# Altium schematic sheet MCU.SchDoc
size A
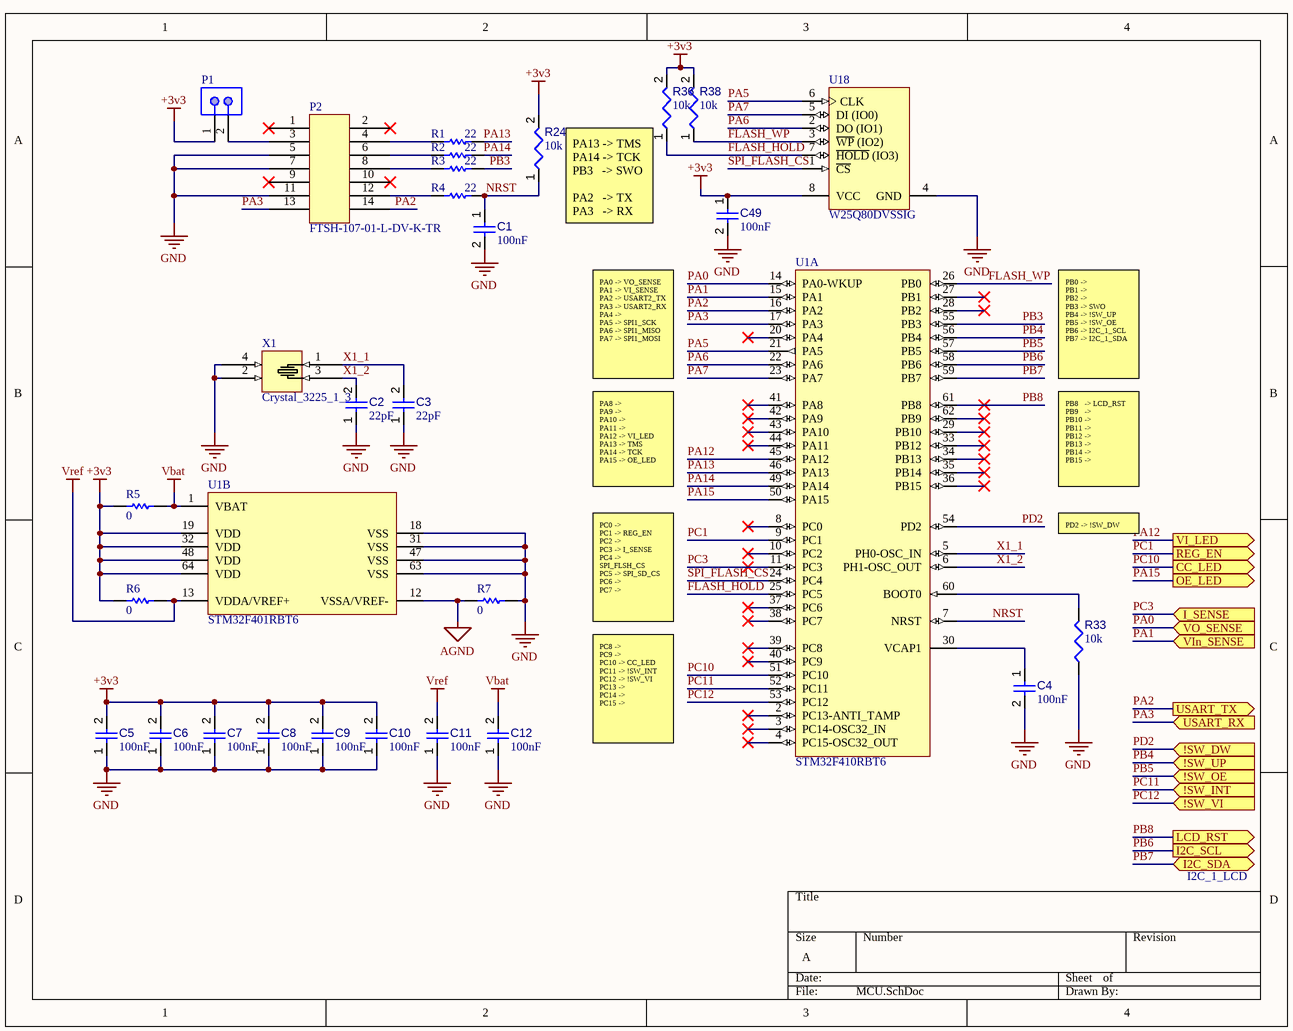
[diagram p0: MCU.SchDoc]

## Parts
C1  value 100nF  [CAPC2013X95X50ML10T25]  (hidden comment: Capacitor 100 nF +/-10% 50 V 0805)
C2  value 22pF  [CAPC2013X95X50ML10T25]  (hidden comment: Capacitor 100 nF +/-10% 50 V 0805)
C3  value 22pF  [CAPC2013X95X50ML10T25]  (hidden comment: Capacitor 100 nF +/-10% 50 V 0805)
C4  value 100nF  [CAPC2013X95X50ML10T25]  (hidden comment: Capacitor 100 nF +/-10% 50 V 0805)
C5  value 100nF  [CAPC2013X95X50ML10T25]  (hidden comment: Capacitor 100 nF +/-10% 50 V 0805)
C6  value 100nF  [CAPC2013X95X50ML10T25]  (hidden comment: Capacitor 100 nF +/-10% 50 V 0805)
C7  value 100nF  [CAPC2013X95X50ML10T25]  (hidden comment: Capacitor 100 nF +/-10% 50 V 0805)
C8  value 100nF  [CAPC2013X95X50ML10T25]  (hidden comment: Capacitor 100 nF +/-10% 50 V 0805)
C9  value 100nF  [CAPC2013X95X50ML10T25]  (hidden comment: Capacitor 100 nF +/-10% 50 V 0805)
C10  value 100nF  [CAPC2013X95X50ML10T25]  (hidden comment: Capacitor 100 nF +/-10% 50 V 0805)
C11  value 100nF  [CAPC2013X95X50ML10T25]  (hidden comment: Capacitor 100 nF +/-10% 50 V 0805)
C12  value 100nF  [CAPC2013X95X50ML10T25]  (hidden comment: Capacitor 100 nF +/-10% 50 V 0805)
C49  value 100nF  [CAPC2013X95X50LL10T25]  (hidden comment: Capacitor 100 nF +/-10% 50 V 0805)
P1  GRPB021VWVN-RC  [SLIN-GRPB021VWVN-RC_V]  (value not drawn)
P2  FTSH-107-01-L-DV-K-TR  [FTSH-107-01-L-DV-K-TR-Footprint-1]
R1  value 22  [RESC2013X50X35ML15T15]  (hidden comment: Resistor 0R +/- 1% 0805 125 mW)
R2  value 22  [RESC2013X50X35ML15T15]  (hidden comment: Resistor 0R +/- 1% 0805 125 mW)
R3  value 22  [RESC2013X50X35ML15T15]  (hidden comment: Resistor 0R +/- 1% 0805 125 mW)
R4  value 22  [RESC2013X50X35ML15T15]  (hidden comment: Resistor 0R +/- 1% 0805 125 mW)
R5  value 0  [RESC2013X50X35ML15T15]  (hidden comment: Resistor 0R +/- 1% 0805 125 mW)
R6  value 0  [RESC2013X50X35ML15T15]  (hidden comment: Resistor 0R +/- 1% 0805 125 mW)
R7  value 0  [RESC2013X50X35ML15T15]  (hidden comment: Resistor 0R +/- 1% 0805 125 mW)
R24  value 10k  [RESC2013X50X35ML15T15]  (hidden comment: Resistor 10k +/-1% 0805 125 mW)
R33  value 10k  [RESC0805(2012)_L]  (hidden comment: Resistor 470R +/-5% 0805 125 mW)
R36  value 10k  [RESC2013X50X35ML15T15]  (hidden comment: Resistor 10k +/-1% 0805 125 mW)
R38  value 10k  [RESC2013X50X35ML15T15]  (hidden comment: Resistor 10k +/-1% 0805 125 mW)
U1  STM32F410RBT6  [STM-LQFP64_N]  (parts A,B of 2)
U18  W25Q80DVSSIG  [WINB-SOIC-8_L]
X1  Crystal_3225_1_3  [Crystal_3225_1_3-Footprint-1]

## Ports
!SW_DW (in), !SW_INT (in), !SW_OE (in), !SW_UP (in), !SW_VI (in), CC_LED (out), I2C_SCL (out), I2C_SDA (bidir), I_SENSE (in), LCD_RST (out), OE_LED (out), REG_EN (out), USART_RX (in), USART_TX (out), VI_LED (out), VIn_SENSE (in), VO_SENSE (in)

## Nets
+3v3: C5.2 C6.2 C7.2 C8.2 C9.2 C10.2 C49.1 P1.1 R5.1 R6.1 R24.2 R36.2 R38.2 U1.19(VDD) U1.32(VDD) U1.48(VDD) U1.64(VDD) U18.8(VCC)
AGND: R7.1 U1.12(VSSA/VREF-)
GND: C1.2 C2.1 C3.1 C4.2 C5.1 C6.1 C7.1 C8.1 C9.1 C10.1 C11.1 C12.1 C49.2 P2.5 P2.7 P2.11 R7.2 R33.1 U1.18(VSS) U1.31(VSS) U1.47(VSS) U1.63(VSS) U18.4(GND) X1.2(GND) X1.4(GND)
Vbat: C12.2 R5.2 U1.1(VBAT)
Vref: C11.2 R6.2 U1.13(VDDA/VREF+)
FLASH_HOLD: R36.1 U1.25(PC5) U18.7(~{HOLD}_(IO3))
FLASH_WP: R38.1 U1.26(PB0) U18.3(~{WP}_(IO2))
NRST: C1.1 R4.2 R24.1 U1.7(NRST)
PA0: U1.14(PA0-WKUP) ; port VO_SENSE
PA1: U1.15(PA1) ; port VIn_SENSE
PA2: P2.14 U1.16(PA2) ; port USART_TX
PA3: P2.13 U1.17(PA3) ; port USART_RX
PA5: U1.21(PA5) U18.6(CLK)
PA6: U1.22(PA6) U18.2(DO_(IO1))
PA7: U1.23(PA7) U18.5(DI_(IO0))
PA12: U1.45(PA12) ; port VI_LED
PA13: R1.2 U1.46(PA13)
PA14: R2.2 U1.49(PA14)
PA15: U1.50(PA15) ; port OE_LED
PB3: R3.2 U1.55(PB3)
PB4: U1.56(PB4) ; port !SW_UP
PB5: U1.57(PB5) ; port !SW_OE
PB6: U1.58(PB6) ; port I2C_SCL
PB7: U1.59(PB7) ; port I2C_SDA
PB8: U1.61(PB8) ; port LCD_RST
PC1: U1.9(PC1) ; port REG_EN
PC3: U1.11(PC3) ; port I_SENSE
PC10: U1.51(PC10) ; port CC_LED
PC11: U1.52(PC11) ; port !SW_INT
PC12: U1.53(PC12) ; port !SW_VI
PD2: U1.54(PD2) ; port !SW_DW
SPI_FLASH_CS: U1.24(PC4) U18.1(~{CS})
X1_1: C3.2 U1.5(PH0-OSC_IN) X1.1(X1)
X1_2: C2.2 U1.6(PH1-OSC_OUT) X1.3(X2)
NetC4_1: C4.1 U1.30(VCAP1)
NetP1_2: P1.2 P2.3
NetP2_4: P2.4 R1.1
NetP2_6: P2.6 R2.1
NetP2_8: P2.8 R3.1
NetP2_12: P2.12 R4.1
NetR33_2: R33.2 U1.60(BOOT0)

Not connected (* = marked no-connect by the designer): P2 1* 2* 9* 10*; U1 2(PC13-ANTI_TAMP)* 3(PC14-OSC32_IN)* 4(PC15-OSC32_OUT)* 8(PC0)* 10(PC2)* 20(PA4)* 27(PB1)* 28(PB2)* 29(PB10)* 33(PB12)* 34(PB13)* 35(PB14)* 36(PB15)* 37(PC6)* 38(PC7)* 39(PC8)* 40(PC9)* 41(PA8)* 42(PA9)* 43(PA10)* 44(PA11)* 62(PB9)*

## Notes on the sheet
- (near R36) PA13 -> TMS
  PA14 -> TCK
  PB3   -> SWO
  PA2   -> TX
  PA3   -> RX
- PA0 -> VO_SENSE
  PA1 -> VI_SENSE
  PA2 -> USART2_TX
  PA3 -> USART2_RX
  PA4 ->
  PA5 -> SPI1_SCK
  PA6 -> SPI1_MISO
  PA7 -> SPI1_MOSI
- PB0 ->
  PB1 ->
  PB2 ->
  PB3 -> SWO
  PB4 -> !SW_UP
  PB5 -> !SW_OE
  PB6 -> I2C_1_SCL
  PB7 -> I2C_1_SDA
- PA8 ->
  PA9 ->
  PA10 ->
  PA11 ->
  PA12 -> VI_LED
  PA13 -> TMS
  PA14 -> TCK
  PA15 -> OE_LED
- PB8   -> LCD_RST
  PB9   ->
  PB10 ->
  PB11 ->
  PB12 ->
  PB13 ->
  PB14 ->
  PB15 ->
- PD2 -> !SW_DW
- PC0 ->
  PC1 -> REG_EN
  PC2 ->
  PC3 -> I_SENSE
  PC4 -> SPI_FLSH_CS
  PC5 -> SPI_SD_CS
  PC6 ->
  PC7 ->
- PC8 ->
  PC9 ->
  PC10 -> CC_LED
  PC11 -> !SW_INT
  PC12 -> !SW_VI
  PC13 ->
  PC14 ->
  PC15 ->
- I2C_1_LCD

## Library data of the parts
C1-C12 = CMP-001-00018-4: Chip Capacitor, 100 nF, +/- 10%, 50 V, 0805 (2012 Metric); Voltage Rating: 50V; Capacitor Type: Ceramic; RoHS Compliant: True; Max Operating Temperature: 125°C; Mounting Technology: SM; Case/Package: 0805; Tolerance: 10%; Min Operating Temperature: -55°C; Pins: 2
C49 = CMP-001-00018-6: Chip Capacitor, 100 nF, +/- 10%, 50 V, 0805 (2012 Metric); Capacitor Type: Ceramic; Voltage Rating: 50V; Pins: 2; Max Operating Temperature: 125°C; Min Operating Temperature: -55°C; Mounting Technology: SM; Case/Package: 0805; RoHS Compliant: True; Tolerance: 10%
P1 = CMP-2000-06371-1: Male Header, Pitch 1.27 mm, 1 x 2 Position, Height 4 mm, Tail Length 2.3 mm, -40 to 105 degC, RoHS, Bulk; Manufacturer: Sullins; Dynamic Catalog: GRPB; Number of Positions Loaded: All; Other Names: S9014E-02; Connector Type: Header,Unshrouded; Catalog Drawings: S9014ESeriesTop; Number of Positions: 2; Pitch: 0.050"(1.27mm); Contact Finish Thickness: Flash; Package Description: Male Header, Pitch 1.27 mm, 1 x 2 Position, Height 4 mm, Tail Length 2.3 mm; Datasheet URL: http://www.sullinscorp.com/drawings/71_GRPB___1VWVN-RC,_10957-C.pdf; Contact Mating Length: 0.118"(3.00mm); Manufacturer URL: http://www.sullinscorp.com/; Mounting Type: ThroughHole; Termination: Solder; Category: Connectors,Interconnects; Family: RectangularConnectors-Headers,MalePins; Contact Finish: Gold; Standard Package: 1; Contact Type: MalePin; Packaging: Bulk; Number of Rows: 1; Mounting Technology: ThroughHole; Package Reference: GRPB021VWVN-RC; Datasheet Version: Rev. C, 12/2008
P2 = CMP-002-00072-1: Conn Unshrouded Header HDR 14 POS 1.27mm Solder ST SMD T/R
R1-R7 = CMP-009-00001-4: Chip Resistor, 0 Ohm, +/- 1%, 125 mW, -55 to 155 degC, 0805 (2012 Metric); Power: 125mW; Voltage Rating: 150V; Tolerance: 1%; Mounting Technology: SM; Min Operating Temperature: -55°C; Case/Package: 0805; Pins: 2; Max Operating Temperature: 155°C; RoHS Compliant: True
R24 R36 R38 = CMP-009-00018-5: Chip Resistor, 10 KOhm, +/- 1%, 125 mW, -55 to 155 degC, 0805 (2012 Metric); Power: 125mW; Voltage Rating: 150V; Tolerance: 1%; Pins: 2; Min Operating Temperature: -55°C; Case/Package: 0805; Max Operating Temperature: 155°C; RoHS Compliant: True; Mounting Technology: SM
R33 = CMP-009-00122-2: Chip Resistor, 470 Ohms, +/-5%, 125 mW, -55 to 155 degC, 0805; Power: 125mW; Tolerance: 5%; Max Operating Temperature: 155°C; Min Operating Temperature: -55°C; Pins: 2; Case/Package: 0805
U1 = CMP-0243-00094-2: ARM Cortex-M4 32-bit MCU+FPU, 105 DMIPS, 128 kB Flash, 64 kB Internal RAM, 48 I/Os, 64-pin LQFP, -40 to 85 degC, Tray; Manufacturer: STMicroelectronics; PartNumber: STM32F401RBT6; Internal RAM Size (kB): 64; FLASH Size (Prog) (kB): 128; Supply Voltage(Vcc) max (V): 3.6; I/Os (High Current): 48; Supply Voltage(Vcc) min (V): 1.8; Operating Frequency(F) (Processor speed) (MHz): 84; Core: ARM Cortex-M4; PackageDescription: 64-Pin Low Profile Quad Flat Package, 10 x 10 mm Body, 0.5 mm Pitch; Mounting Technology: Surface Mount; PackageVersion: Rev. 4, 06/2013; ComponentLink1URL: http://www.st.com/web/en/home.html; ComponentLink3Description: Package Specification; ComponentLink2Description: Datasheet; ComponentLink3URL: http://www.st.com/st-web-ui/static/active/en/resource/technical/document/datasheet/DM00037051.pdf; ComponentLink2URL: http://www.st.com/st-web-ui/static/active/en/resource/technical/document/data_brief/DM00071938.pdf; DatasheetVersion: Rev. 1; Packing: Tray; PackageReference: LQFP64; ComponentLink1Description: Manufacturer URL
U18 = CMP-2000-07408-1: Serial Flash Memory with Dual and Quad SPI, 8 Mbits, 2.7 to 3.6 V, -40 to 85 degC, 8-Pin SOIC (SS), RoHS, Tube; Manufacturer: WinbondElectronics; Speed: 104MHz; Memory Size: 8M(1Mx8); Interface: SPISerial; Memory Type: FLASH-NOR; Voltage - Supply: 2.7V~3.6V; Mounting Technology: SurfaceMount; Datasheet URL: http://www.winbond.com/resource-files/w25q80dv_revg_07212015.pdf?__locale=zh_TW; Family: Memory; Package / Case: 8-SOIC(0.209",5.30mmWidth); Manufacturer URL: http://www.winbond.com/hq/index.html?__locale=en; Format - Memory: FLASH; Series: SpiFlash®; Package Reference: SS-8; Package Description: 8-Pin Small Outline Integrated Circuit, Body 5.28 x 5.28 mm, Pitch 1.27 mm; Supplier Device Package: 8-SOIC; Datasheet Version: Rev. G, 07/2015; Category: IntegratedCircuits(ICs); Packaging: Tube; Operating Temperature: -40°C~85°C(TA)
X1 = CMP-003-00030-1: 3225 crystal